# Altium schematic sheet ECG_Schematic_.SchDoc
size 431 x 279 mm; SheetNumber: 1; SheetTotal: 1
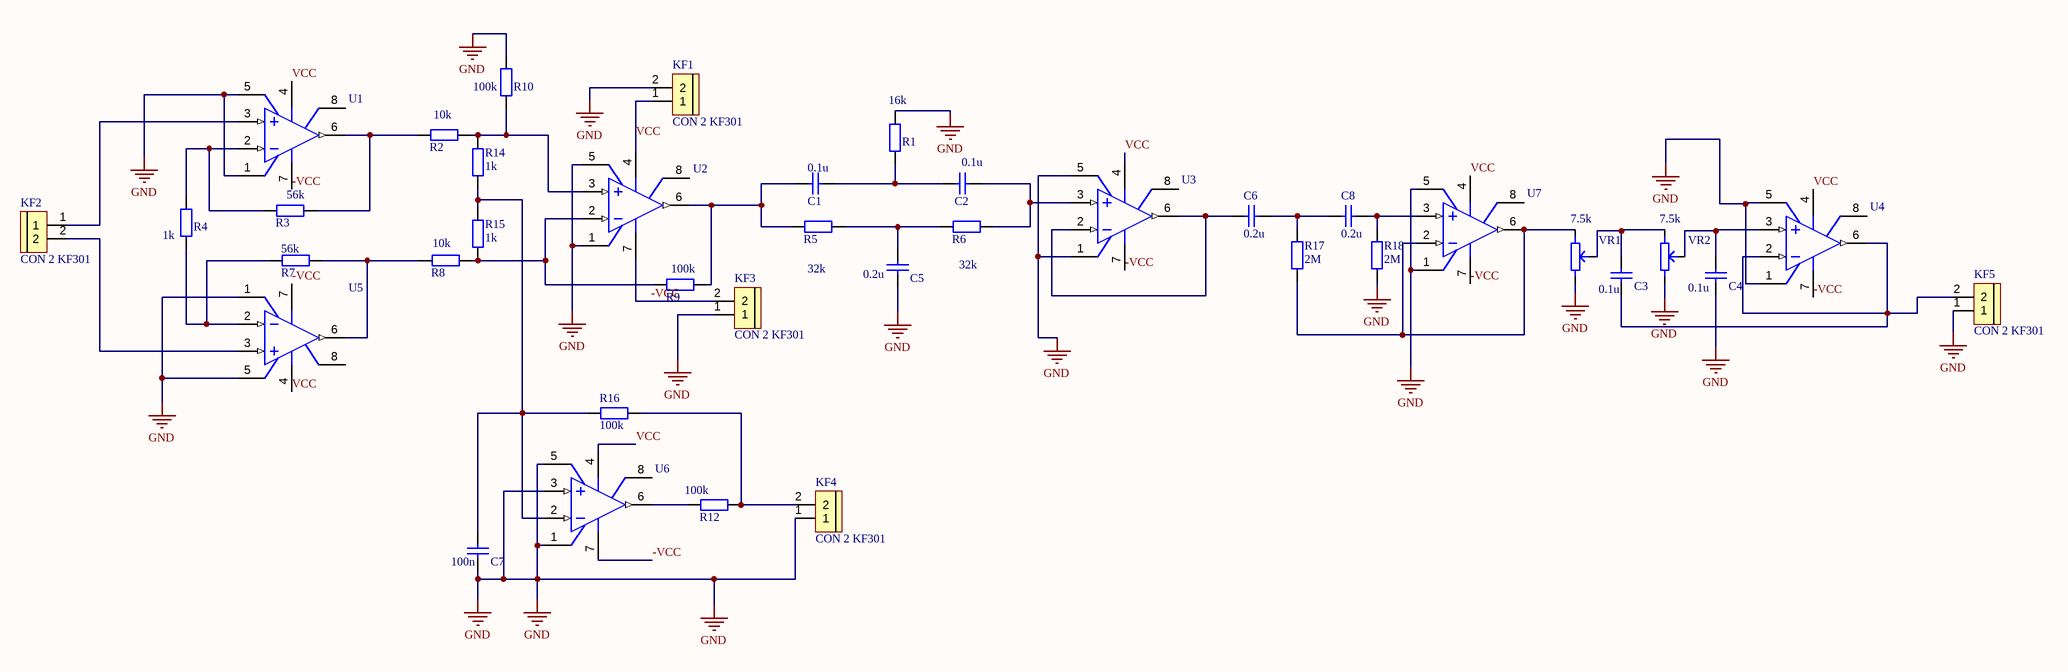
[diagram p0: ECG_Schematic_.SchDoc]

## Parts
C1  0.1u  [tu gom]
C2  0.1u  [tu gom]
C3  0.1u  [tu gom]
C4  0.1u  [tu gom]
C5  0.2u  [tu gom]
C6  0.2u  [tu gom]
C7  100n  [tu gom]
C8  0.2u  [tu gom]
KF1  CON 2 KF301  [Con 2 KF301 5.08]
KF2  CON 2 KF301  [Con 2 KF301 5.08]
KF3  CON 2 KF301  [Con 2 KF301 5.08]
KF4  CON 2 KF301  [Con 2 KF301 5.08]
KF5  CON 2 KF301  [Con 2 KF301 5.08]
R1  16k  [tro vach 1/4w]
R2  10k  [tro vach 1/4w]
R3  56k  [tro vach 1/4w]
R4  1k  [tro vach 1/4w]
R5  32k  [tro vach 1/4w]
R6  32k  [tro vach 1/4w]
R7  56k  [tro vach 1/4w]
R8  10k  [tro vach 1/4w]
R9  100k  [tro vach 1/4w]
R10  100k  [tro vach 1/4w]
R12  100k  [tro vach 1/4w]
R14  1k  [tro vach 1/4w]
R15  1k  [tro vach 1/4w]
R16  100k  [tro vach 1/4w]
R17  2M  [tro vach 1/4w]
R18  2M  [tro vach 1/4w]
U1  LM741CN/NOPB  [P0008A]  (value not drawn)
U2  LM741CN/NOPB  [P0008A]  (value not drawn)
U3  LM741CN/NOPB  [P0008A]  (value not drawn)
U4  LM741CN/NOPB  [P0008A]  (value not drawn)
U5  B  [P0008A]  (value not drawn)
U6  B  [P0008A]  (value not drawn)
U7  LM741CN/NOPB  [P0008A]  (value not drawn)
VR1  7.5k  [Bien Tro Tam Giac Nam]
VR2  7.5k  [Bien Tro Tam Giac Nam]

## Nets
GND: C4.2 C5.2 C7.2 KF1.2 KF3.1 KF4.1 KF5.1 R1.2 R10.2 R18.1 U1.1(OFS_NULL) U1.5(OFS_NULL) U2.1(OFS_NULL) U2.5(OFS_NULL) U3.1(OFS_NULL) U3.5(OFS_NULL) U4.1(OFS_NULL) U4.5(OFS_NULL) U5.1(OFS_NULL) U5.5(OFS_NULL) U6.1(OFS_NULL) U6.3(IN+) U6.5(OFS_NULL) U7.1(OFS_NULL) U7.5(OFS_NULL) VR1.3 VR2.3
-VCC: KF3.2 U1.7(V+) U2.7(V+) U3.7(V+) U4.7(V+) U5.7(V+) U6.7(V+) U7.7(V+)
VCC: KF1.1 U1.4(V-) U2.4(V-) U3.4(V-) U4.4(V-) U5.4(V-) U6.4(V-) U7.4(V-)
NetC1_1: C1.1 C2.2 R1.1
NetC1_2: C1.2 R5.1 R9.2 U2.6(OUT)
NetC2_1: C2.1 R6.2 U3.3(IN+)
NetC3_1: C3.1 VR1.2 VR2.1
NetC3_2: C3.2 KF5.2 U4.2(IN-) U4.6(OUT)
NetC4_1: C4.1 U4.3(IN+) VR2.2
NetC5_1: C5.1 R5.2 R6.1
NetC6_1: C6.1 U3.2(IN-) U3.6(OUT)
NetC6_2: C6.2 C8.1 R17.2
NetC7_1: C7.1 R14.1 R15.2 R16.1 U6.2(IN-)
NetC8_2: C8.2 R18.2 U7.3(IN+)
NetKF2_1: KF2.1 U1.3(IN+)
NetKF2_2: KF2.2 U5.3(IN+)
NetKF4_2: KF4.2 R12.1 R16.2
NetR2_1: R2.1 R3.2 U1.6(OUT)
NetR2_2: R2.2 R10.1 R14.2 U2.3(IN+)
NetR3_1: R3.1 R4.2 U1.2(IN-)
NetR4_1: R4.1 R7.1 U5.2(IN-)
NetR7_2: R7.2 R8.1 U5.6(OUT)
NetR8_2: R8.2 R9.1 R15.1 U2.2(IN-)
NetR12_2: R12.2 U6.6(OUT)
NetR17_1: R17.1 U7.2(IN-) U7.6(OUT) VR1.1

Not connected (* = marked no-connect by the designer): U1 8(NC); U2 8(NC); U3 8(NC); U4 8(NC); U5 8(NC); U6 8(NC); U7 8(NC)

## Notes on the sheet
- DWG. NO.
- REV.
- SHT.
- THIS DOCUMENT AND THE DATA DISCLOSED HEREIN OR HEREWITH IS THE PROPERTY OF ALTIUM LIMITED AND MAY BE FREELY DISTRIBUTED IN WHOLE. NO RIGHTS ARE RESERVED OR EXPRESS OR IMPLIED WARANTEE GIVEN.
- REVISION
- DESCRIPTION
- DATE
- APPROVED
- ENG:
- APPROVALS
- PROJECT
- DSN:
- CHK:
- REFERENCE DOCUMENTS
- PROJECT REVISION:
- TITLE
- DOCUMENT REVISION:
- DESIGN ITEM:
- BOM:
- FAB DWG:
- PCB DWG:
- ASSY DWG:
- SCALE:
- SIZE
- B
- CAGE CODE
- FILE NAME
- DWG NO.
- SHEET
- OF
- REV

## Library data of the parts
C1-C8 = CMP-001-00153-1: C?m; So_Chan: 2; Don_Vi: Con; Ma_Hang: MH004779; Ten_Linh_Kien: T? g?m 47P 50V; Component Type: Standard; Kieu_Chan: *; Source: Tu dien.SchLib; Design Item ID: Tu gom 47pF 50V; Pins: 2; Chung_Loai: C?m
KF1-KF3 = CMP-002-00076-1: C?m; Ten_Linh_Kien: CON 2 KF301-2P 5.08MM Xanh Dýõng; Ma_Hang: MH000987; Don_Vi: Con; Chung_Loai: C?m; Kieu_Chan: *; Design Item ID: CON 2 KF301; Ghi_Chu: *; Source: Connector.SchLib; Pins: 2; Component Type: Standard
KF4 KF5 = CON 2 KF301: Cắm; Ma_Hang: MH000987; Ten_Linh_Kien: CON 2 KF301-2P 5.08MM Xanh Dương; Chung_Loai: Cắm; Ghi_Chu: *; Kieu_Chan: *; Don_Vi: Con
R1-R10 R12 R17 R18 = CMP-009-00543-1: C?m; So_Chan: 2; Don_Vi: Con; Ma_Hang: MH007285; Ten_Linh_Kien: Tr? V?ch 1/4w 5% 1.8k; Pins: 2; Source: Dien Tro.SchLib; Design Item ID: Tro Vach 1/4W 5% 1.8k; Kieu_Chan: *; Component Type: Standard; Chung_Loai: C?m
R14-R16 = Tro Vach 1/4W 1% 3k: Cắm; Don_Vi: Con; So_Chan: 2; Ten_Linh_Kien: Trở Vạch 1/4W 1% 3k; Ma_Hang: MH008834; Chung_Loai: Cắm; Kieu_Chan: *
U1-U7 = CMP-0055-00162-3: Operational Amplifier, 8-pin MDIP, Pb-Free; Manufacturer: Texas Instruments; PackageTopMarking: NSUZXYTTE#*LM*741CN; PowerWise: N; CompType: Amplifiers; ComponentLink1Description: Datasheet URL; ComponentLink1URL: http://www.ti.com/general/docs/lit/getliterature.tsp?genericPartNumber=LM741&fileType=pdf; PackageDescription: MDIP, .365 x .250 x .130in, 8 Lead, .100in Pitch; RoHS: Y; PinCount: 8; Code_JEDEC: MS-001-BA; Package Reference: P0008A
VR1 VR2 = CMP-019-000030-1: C?m; Don_Vi: Con; Ma_Hang: MH004025; Ten_Linh_Kien: Bi?n Tr? Tam Giác 103-10K RM063 (Chân n?m); Source: Dien Tro.SchLib; Pin Count: 3; Chung_Loai: C?m; Design Item ID: Bien tro tam giac 10K Nam; Component Type: Standard; Kieu_Chan: *